# EAGLE design fonte_simoes (EAGLE 9.6.2)
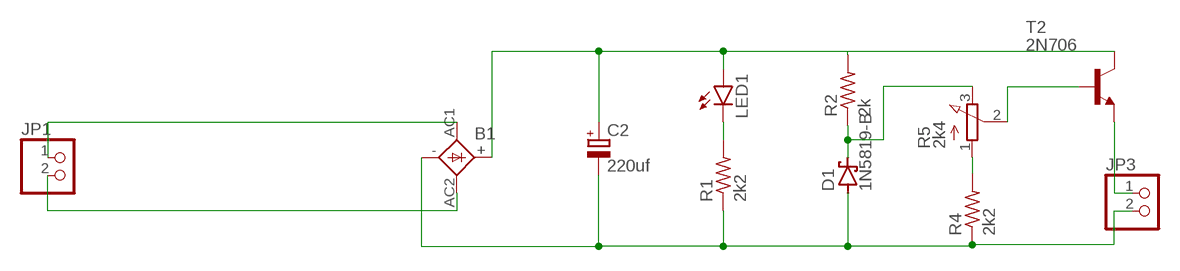
[diagram p0: schematic, sheet 1]

## Parts
B1  1KAB  [1KAB]
C2  220uf  CPOL-EUTT5D10  [TT5D10]
D1  1N5819-B  [DO41-7.6]
JP1  PINHD-1X2  [1X02]
JP3  PINHD-1X2  [1X02]
LED1  LED5MM  [LED5MM]
R1  2k2  R-US_0309/12  [0309/12]
R2  2k  R-US_0309/12  [0309/12]
R4  2k2  R-US_0309/12  [0309/12]
R5  2k4  3RP/1610N  [3RP/1610N]
T2  2N706  [TO18]

## Nets
N$3: B1.AC1 JP1.1
N$4: B1.AC2 JP1.2
N$5: B1.+ C2.+ LED1.A R2.2 T2.3(C)
N$6: B1.- C2.- D1.A JP3.2 R1.1 R4.1
N$7: LED1.K(C) R1.2
N$8: D1.C R2.1 R5.3(E)
N$9: R5.2(S) T2.2(B)
N$10: R4.2 R5.1(A)
N$11: JP3.1 T2.1(E)

## Library data of the parts
B1 = rectifier:1KAB: RECTIFIER grid 5,08 x 5,08 mm
C2 = rcl:CPOL-EU: POLARIZED CAPACITOR, European symbol; SPICEPREFIX: C
D1 = diode:1N581*: 1.0A SCHOTTKY BARRIER RECTIFIER Source: http://www.diodes.com/datasheets/ds23001.pdf
JP1 JP3 = pinhead:PINHD-1X2: PIN HEADER
LED1 = led:LED: LED OSRAM: - CHIPLED LG R971, LG N971, LY N971, LG Q971, LY Q971, LO R971, LY R971 LH N974, LH R974 LS Q976, LO Q976, LY Q976 LO Q996 - Hyper CHIPLED LW Q18S LB Q993, LB Q99A, LB R99A - SideLED LS A670, LO A670, LY A670, LG A670, LP A670 LB A673, LV A673, LT A673, LW A673 LH A674 LY A675 LS A676, LA A676, LO A676, LY A676, LW A676 LS A679, LY A679, LG A679 - Hyper Micro SIDELED® LS Y876, LA Y876, LO Y876, LY Y876 LT Y87S - SmartLED LW L88C, LW L88S LB L89C, LB L89S, LG L890 LS L89K, LO L89K, LY L89K LS L896, LA L896, LO L896, LY L896 - TOPLED LS T670, LO T670, LY T670, LG T670, LP T670 LSG T670, LSP T670, LSY T670, LOP T670, LYG T670 LG T671, LOG T671, LSG T671 LB T673, LV T673, LT T673, LW T673 LH T674 LS T676, LA T676, LO T676, LY T676, LB T676, LH T676, LSB T676, LW T676 LB T67C, LV T67C, LT T67C, LS T67K, LO T67K, LY T67K, LW E67C LS E67B, LA E67B, LO E67B, LY E67B, LB E67C, LV E67C, LT E67C LW T67C LS T679, LY T679, LG T679 LS T770, LO T770, LY T770, LG T770, LP T770 LB T773, LV T773, LT T773, LW T773 LH T774 LS E675, LA E675, LY E675, LS T675 LS T776, LA T776, LO T776, LY T776, LB T776 LHGB T686 LT T68C, LB T68C - Hyper Mini TOPLED® LB M676 - Mini TOPLED Santana® LG M470 LS M47K, LO M47K, LY M47K Source: http://www.osram.convergy.de LUXEON: - LUMILED® LXK2-PW12-R00, LXK2-PW12-S00, LXK2-PW14-U00, LXK2-PW14-V00 LXK2-PM12-R00, LXK2-PM12-S00, LXK2-PM14-U00 LXK2-PE12-Q00, LXK2-PE12-R00, LXK2-PE12-S00, LXK2-PE14-T00, LXK2-PE14-U00 LXK2-PB12-K00, LXK2-PB12-L00, LXK2-PB12-M00, LXK2-PB14-N00, LXK2-PB14-P00, LXK2-PB14-Q00 LXK2-PR12-L00, LXK2-PR12-M00, LXK2-PR14-Q00, LXK2-PR14-R00 LXK2-PD12-Q00, LXK2-PD12-R00, LXK2-PD12-S00 LXK2-PH12-R00, LXK2-PH12-S00 LXK2-PL12-P00, LXK2-PL12-Q00, LXK2-PL12-R00 Source: www.luxeon.com KINGBRIGHT: KA-3528ASYC Source: www.kingbright.com
R1 R2 R4 = rcl:R-US_: RESISTOR, American symbol; SPICEPREFIX: R
R5 = pot:3RP/1610N: 16mm Potentiometer one level Source: http://www.alphapotentiometers.net/html/16mm_pot_2.html
T2 = transistor:2N706: NPN TRANSISTOR

## Board
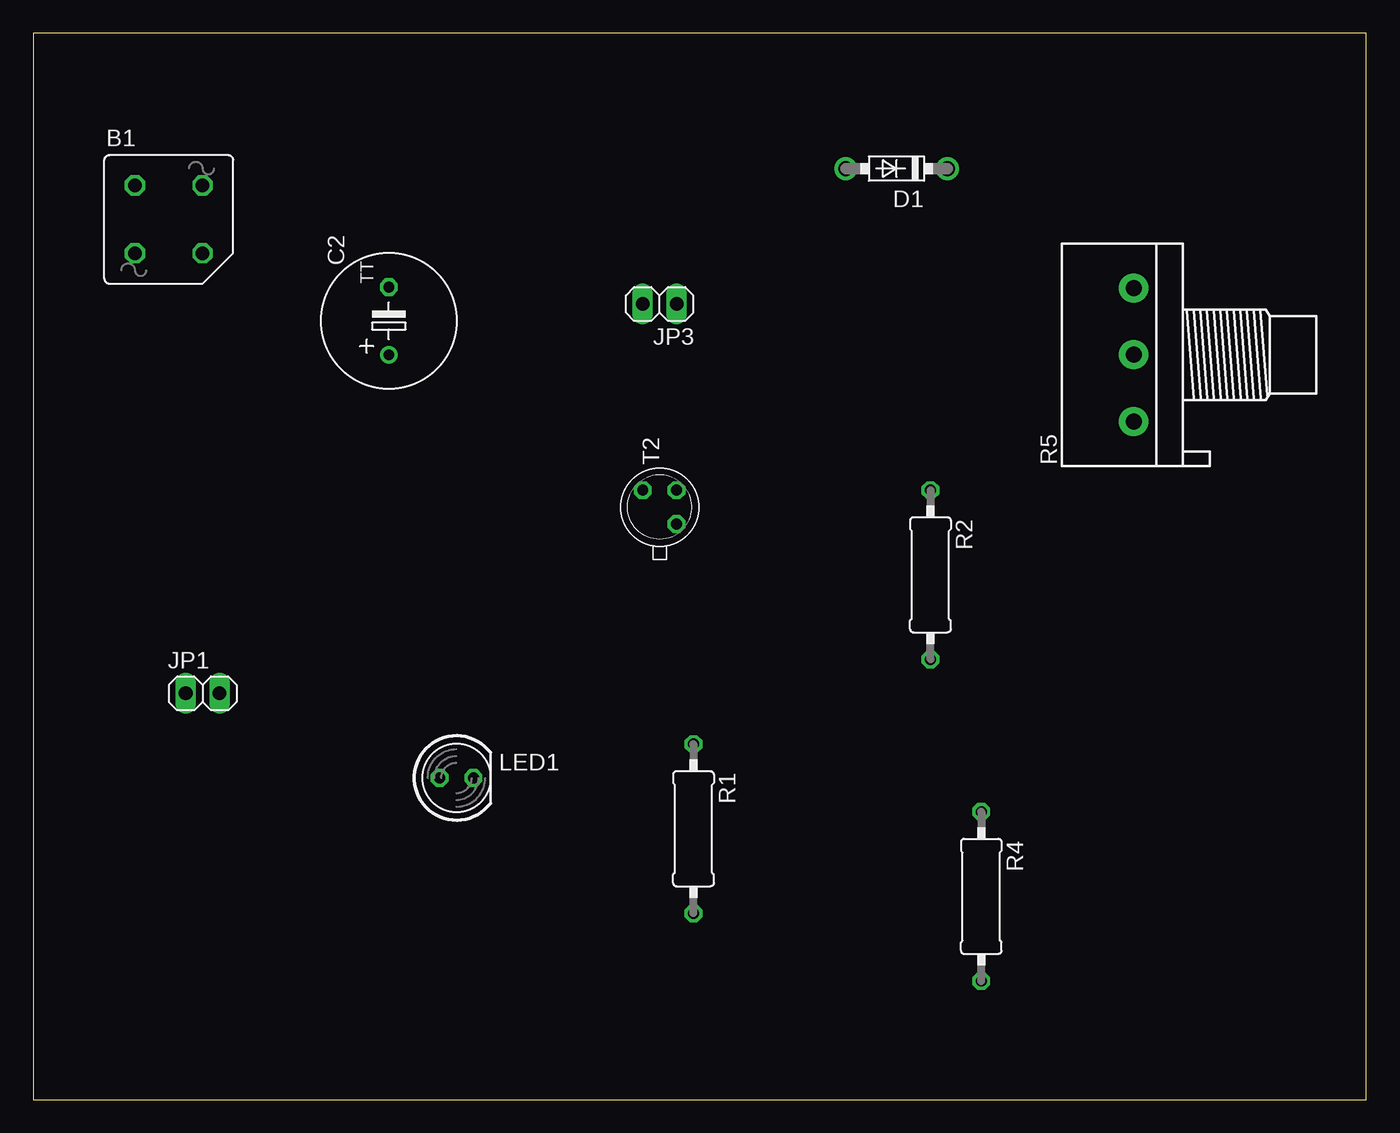
[diagram p1: board, top side]
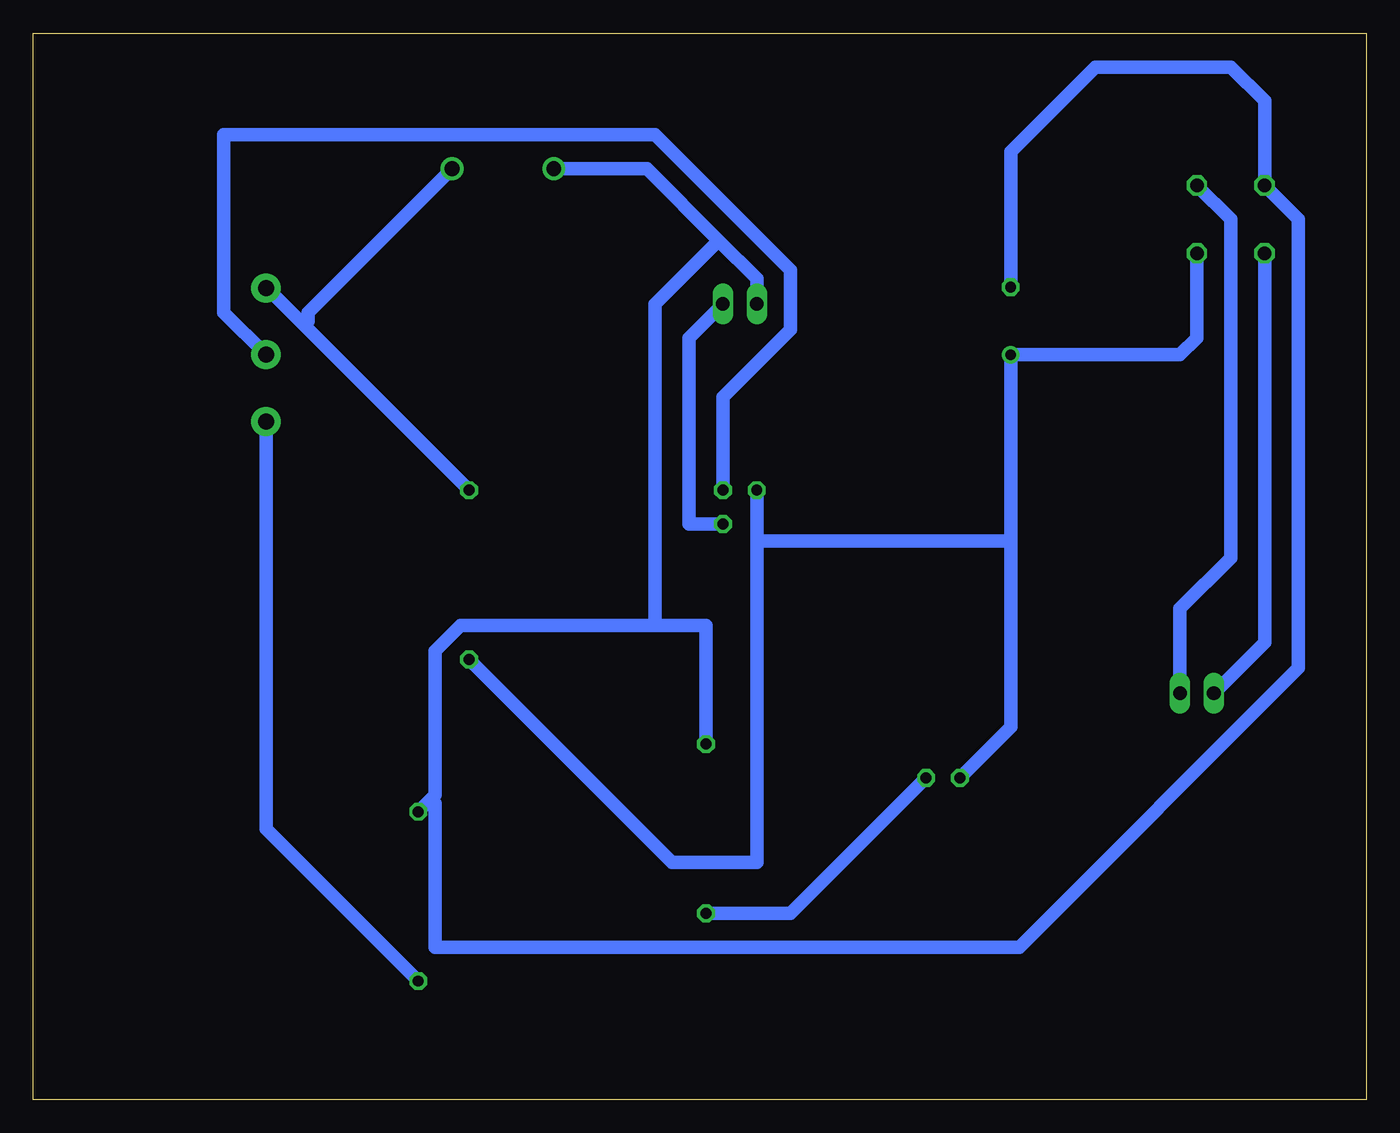
[diagram p2: board, bottom side, seen from below]

Size 100 x 80 mm. Coordinates in mm from the lower left corner, seen from the top.
Outline: 0,0 100,0 100,80 0,80 0,0
Copper layers (1*16): Top 0.035mm / dielectric 1.5mm / Bottom 0.035mm
Design rules "default *": minimum track width 40mil, minimum drill 0.35mm, track to track 40mil, track to pad 40mil, pad to pad 40mil, via to via 40mil, smd to smd 6mil, copper to edge 40mil, drill to drill 6mil, minimum pad ring 10mil, minimum via ring 8mil, stop-mask expansion 4mil, vias tented up to drill 0mil, thermal gap 10mil

### Footprints (pad centres in the part's own frame; a part is rotated, then mirrored left to right if it is on the bottom)
1KAB = drill 1.016 octagon: + 2.54,-2.54; - -2.54,2.54; AC1 -2.54,-2.54; AC2 2.54,2.54
TT5D10 = drill 0.813: + -2.54,0 | drill 0.813 octagon: - 2.54,0
DO41-7.6 = drill 1.1 pad 1.7: A 3.81,0; C -3.81,0
1X02 = drill 1.016 long: 1 -1.27,0; 2 1.27,0
LED5MM = drill 0.813 octagon: A -1.27,0; K 1.27,0
0309/12 = drill 0.813 octagon: 1 -6.35,0; 2 6.35,0
3RP/1610N = drill 1.2 pad 2.184: 1 -5,0; 2 0,0; 3 5,0
TO18 = drill 0.813 octagon: 1 -1.27,-1.27; 2 1.27,-1.27; 3 1.27,1.27

### Placement (x,y rotation side)
B1  10.16,66.04 0 top
C2  26.67,58.42 90 top
D1  64.77,69.85 180 top
JP1  12.7,30.48 0 top
JP3  46.99,59.69 180 top
LED1  31.75,24.13 0 top
R1  49.53,20.32 270 top
R2  67.31,39.37 270 top
R4  71.12,15.24 270 top
R5  82.55,55.88 90 top
T2  46.99,44.45 90 top

### Tracks (layer width: path | path; a pad name or v marks a point on that pad's centre or on a via)
N$3
  Bottom 1.016: B1.AC1 7.62,34.29 JP1.1
N$4
  Bottom 1.016: B1.AC2 10.16,66.04 10.16,40.64 13.97,36.83 JP1.2
N$5
  Bottom 1.016: B1.+ 12.7,57.15 13.97,55.88 C2.+ 26.67,41.91 | LED1.A 26.67,27.94 26.67,41.91 | R2.2 52.07,17.78 45.72,17.78 45.72,41.91 | T2.3 45.72,41.91 | 45.72,41.91 26.67,41.91
N$6
  Bottom 1.016: C2.- 26.67,71.12 20.32,77.47 10.16,77.47 7.62,74.93 B1.- 5.08,66.04 5.08,32.38 26.04,11.43 69.85,11.43 69.85,22.23 70.17,22.54 | JP3.2 45.72,61.59 48.58,64.45 | 48.58,64.45 53.98,69.85 D1.A | 70.17,22.54 69.85,22.86 69.85,33.66 67.94,35.56 53.34,35.56 | 70.17,22.54 R4.1 | 53.34,35.56 49.53,35.56 R1.1 | 48.58,64.45 53.34,59.69 53.34,35.56
N$7
  Bottom 1.016: LED1.K 43.18,13.97 R1.2
N$8
  Bottom 1.016: 79.69,58.1 82.55,60.96 R5.3 | 79.69,58.1 R2.1 | D1.C 79.38,59.05 79.38,58.42 79.69,58.1
N$9
  Bottom 1.016: T2.2 48.26,52.7 43.18,57.78 43.18,62.23 53.34,72.39 85.72,72.39 85.72,59.05 R5.2
N$10
  Bottom 1.016: R4.2 82.55,20.32 R5.1
N$11
  Bottom 1.016: T2.1 50.8,43.18 50.8,57.15 JP3.1